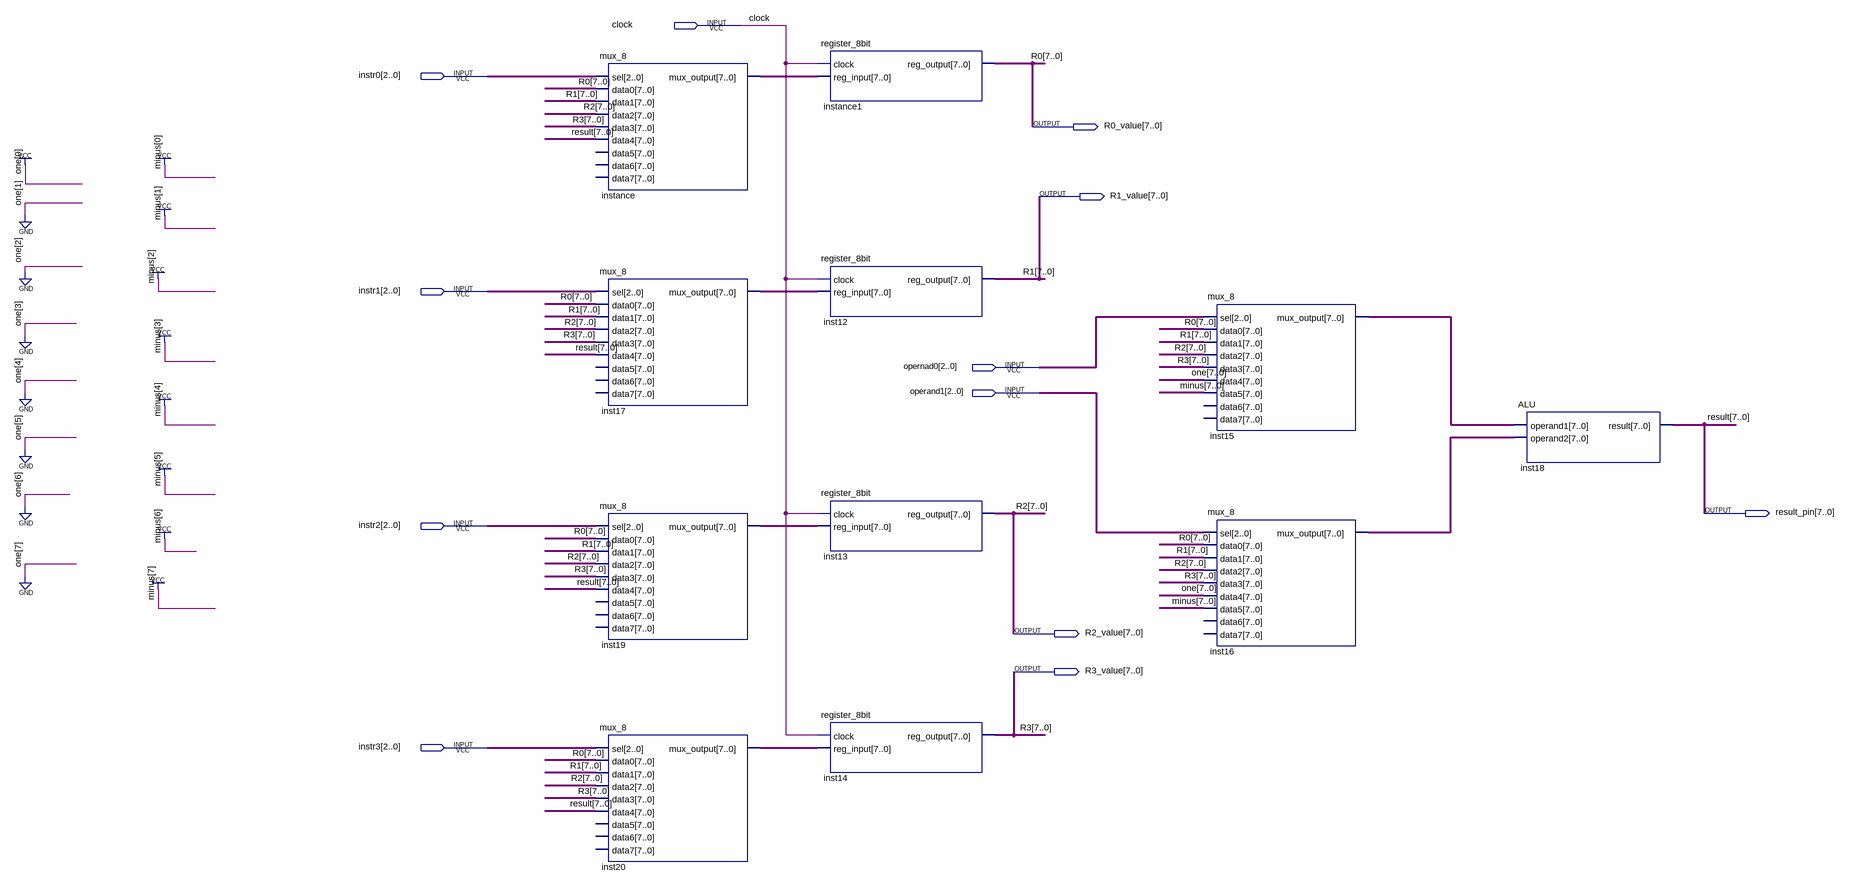
[diagram p0: schematic sheet]
// Quartus schematic Q1.bdf as structural Verilog: 11 symbols, 12 pins
module Q1 (
  input  clock,
  input  [2:0] instr0,
  input  [2:0] instr1,
  input  [2:0] opernad0,
  input  [2:0] operand1,
  input  [2:0] instr2,
  input  [2:0] instr3,
  output [7:0] R0_value,
  output [7:0] R1_value,
  output [7:0] result_pin,
  output [7:0] R2_value,
  output [7:0] R3_value
);

  wire [7:0] inst15_mux_output, inst16_mux_output, inst17_mux_output, inst19_mux_output, inst20_mux_output,
       instance_mux_output;

  mux_8 \instance  (
    .sel(instr0), .data0(R0_value), .data1(R1_value), .data2(R2_value), .data3(R3_value), .data4(result_pin),
    .mux_output(instance_mux_output));  // open: data5, data6, data7
  mux_8 inst17 (
    .sel(instr1), .data0(R0_value), .data1(R1_value), .data2(R2_value), .data3(R3_value), .data4(result_pin),
    .mux_output(inst17_mux_output));  // open: data5, data6, data7
  mux_8 inst19 (
    .sel(instr2), .data0(R0_value), .data1(R1_value), .data2(R2_value), .data3(R3_value), .data4(result_pin),
    .mux_output(inst19_mux_output));  // open: data5, data6, data7
  mux_8 inst20 (
    .sel(instr3), .data0(R0_value), .data1(R1_value), .data2(R2_value), .data3(R3_value), .data4(result_pin),
    .mux_output(inst20_mux_output));  // open: data5, data6, data7
  register_8bit instance1 (.clock(clock), .reg_input(instance_mux_output), .reg_output(R0_value));
  register_8bit inst12 (.clock(clock), .reg_input(inst17_mux_output), .reg_output(R1_value));
  register_8bit inst13 (.clock(clock), .reg_input(inst19_mux_output), .reg_output(R2_value));
  register_8bit inst14 (.clock(clock), .reg_input(inst20_mux_output), .reg_output(R3_value));
  mux_8 inst15 (
    .sel(opernad0), .data0(R0_value), .data1(R1_value), .data2(R2_value), .data3(R3_value),
    .data4(8'b00000001), .data5({8{1'b1}}), .mux_output(inst15_mux_output));  // open: data6, data7
  mux_8 inst16 (
    .sel(operand1), .data0(R0_value), .data1(R1_value), .data2(R2_value), .data3(R3_value),
    .data4(8'b00000001), .data5({8{1'b1}}), .mux_output(inst16_mux_output));  // open: data6, data7
  ALU inst18 (.operand1(inst15_mux_output), .operand2(inst16_mux_output), .result(result_pin));

  // Other names for the same wires on the sheet: R0[7:0] = R0_value; R1[7:0] = R1_value; R2[7:0] = R2_value;
  //   R3[7:0] = R3_value; result[7:0] = result_pin
endmodule
